# Altium schematic sheet connector_button.SchDoc
size A
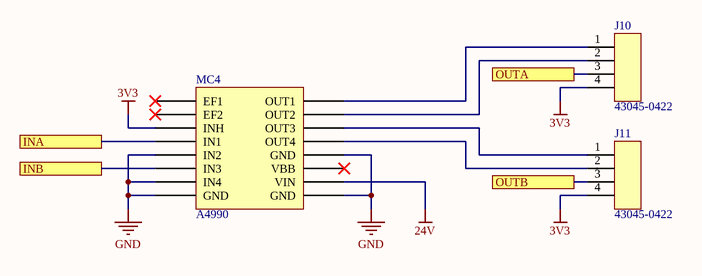
[diagram p0: connector_button.SchDoc]

## Parts
J10  MFG P/N: 43045-0422  [MOLEX_MICROFIT_DOUBLE_ROW_RA_TH_4POS_43045-0422]  (hidden comment: CONN_MOLEX_MICROFIT_DOUBLE_ROW_RA_TH_4POS_LOCK)
J11  MFG P/N: 43045-0422  [MOLEX_MICROFIT_DOUBLE_ROW_RA_TH_4POS_43045-0422]  (hidden comment: CONN_MOLEX_MICROFIT_DOUBLE_ROW_RA_TH_4POS_LOCK)
MC4  A4990  [A4990 Dual Motor Driver Carrier]

## Ports
INA, INB, OUTA, OUTB

## Nets
3V3: J10.4 J11.4 MC4.3(INH)
24V: MC4.10(VIN)
GND: MC4.5(IN2) MC4.7(IN4) MC4.8(GND) MC4.9(GND) MC4.12(GND)
INA: MC4.4(IN1) ; port INA
INB: MC4.6(IN3) ; port INB
OUTA: J10.3 ; port OUTA
OUTB: J11.3 ; port OUTB
NetJ10_1: J10.1 MC4.16(OUT1)
NetJ10_2: J10.2 MC4.15(OUT2)
NetJ11_1: J11.1 MC4.14(OUT3)
NetJ11_2: J11.2 MC4.13(OUT4)

Not connected (* = marked no-connect by the designer): MC4 1(EF1)* 2(EF2)* 11(VBB)*

## Library data of the parts
J10 J11 = 164: CONN MOLEX MICROFIT 4POS RA GOLD; ID: 164; MFG: Molex Inc; Pitch: 3.00mm (0.118"); Number of Positions: 4; Gender: Male; COMMON: 210-00301-00; Status: In-Development; RoHS Compliant: Yes; Mounting Type: Through Hole; Orientation: Right Angle; Number of Rows: 2; Row Spacing: 3.00mm (0.118"); Features: Board Lock, Locking Ramp, Shrouded; Supplier 1: Digi-Key; HelpURL: http://www.molex.com/pdm_docs/sd/430450221_sd.pdf; ComponentLink1Description: Datasheet; ComponentLink1URL: http://www.molex.com/pdm_docs/sd/430450221_sd.pdf; LOON: 210-00301-00; XPN: 210-00301-00; Gecko: 210-00301-00
MC4 = A4990 Dual Motor Driver Carrier